# Altium schematic sheet ModuleAudioBluetooth.SchDoc
size A
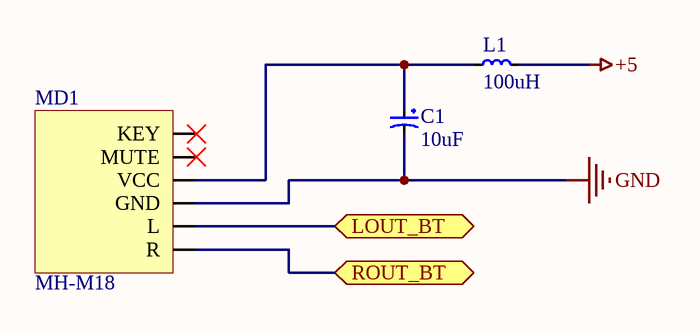
[diagram p0: ModuleAudioBluetooth.SchDoc]

## Parts
C1  10uF  [C-ELE-1.5-4X7MM]
L1  100uH  [L-PK0406-2-5X8MM]
MD1  MH-M18  [MH-M18]

## Ports
LOUT_BT (bidir), ROUT_BT (bidir)

## Nets
+5: L1.2
GND: C1.2 MD1.4(GND)
LOUT_BT: MD1.5(L) ; port LOUT_BT
ROUT_BT: MD1.6(R) ; port ROUT_BT
NetC1_1: C1.1 L1.1 MD1.3(VCC)

Not connected (* = marked no-connect by the designer): MD1 1(KEY)* 2(MUTE)*

## Library data of the parts
C1 = CAP-ELE: Cac Loai Tu Hoa
L1 = IND: Cac Loai Cuon Cam Don
MD1 = MH-M18: Module Thu Audio Bluetooth